# EAGLE design usbswitch (EAGLE 7.5.0)
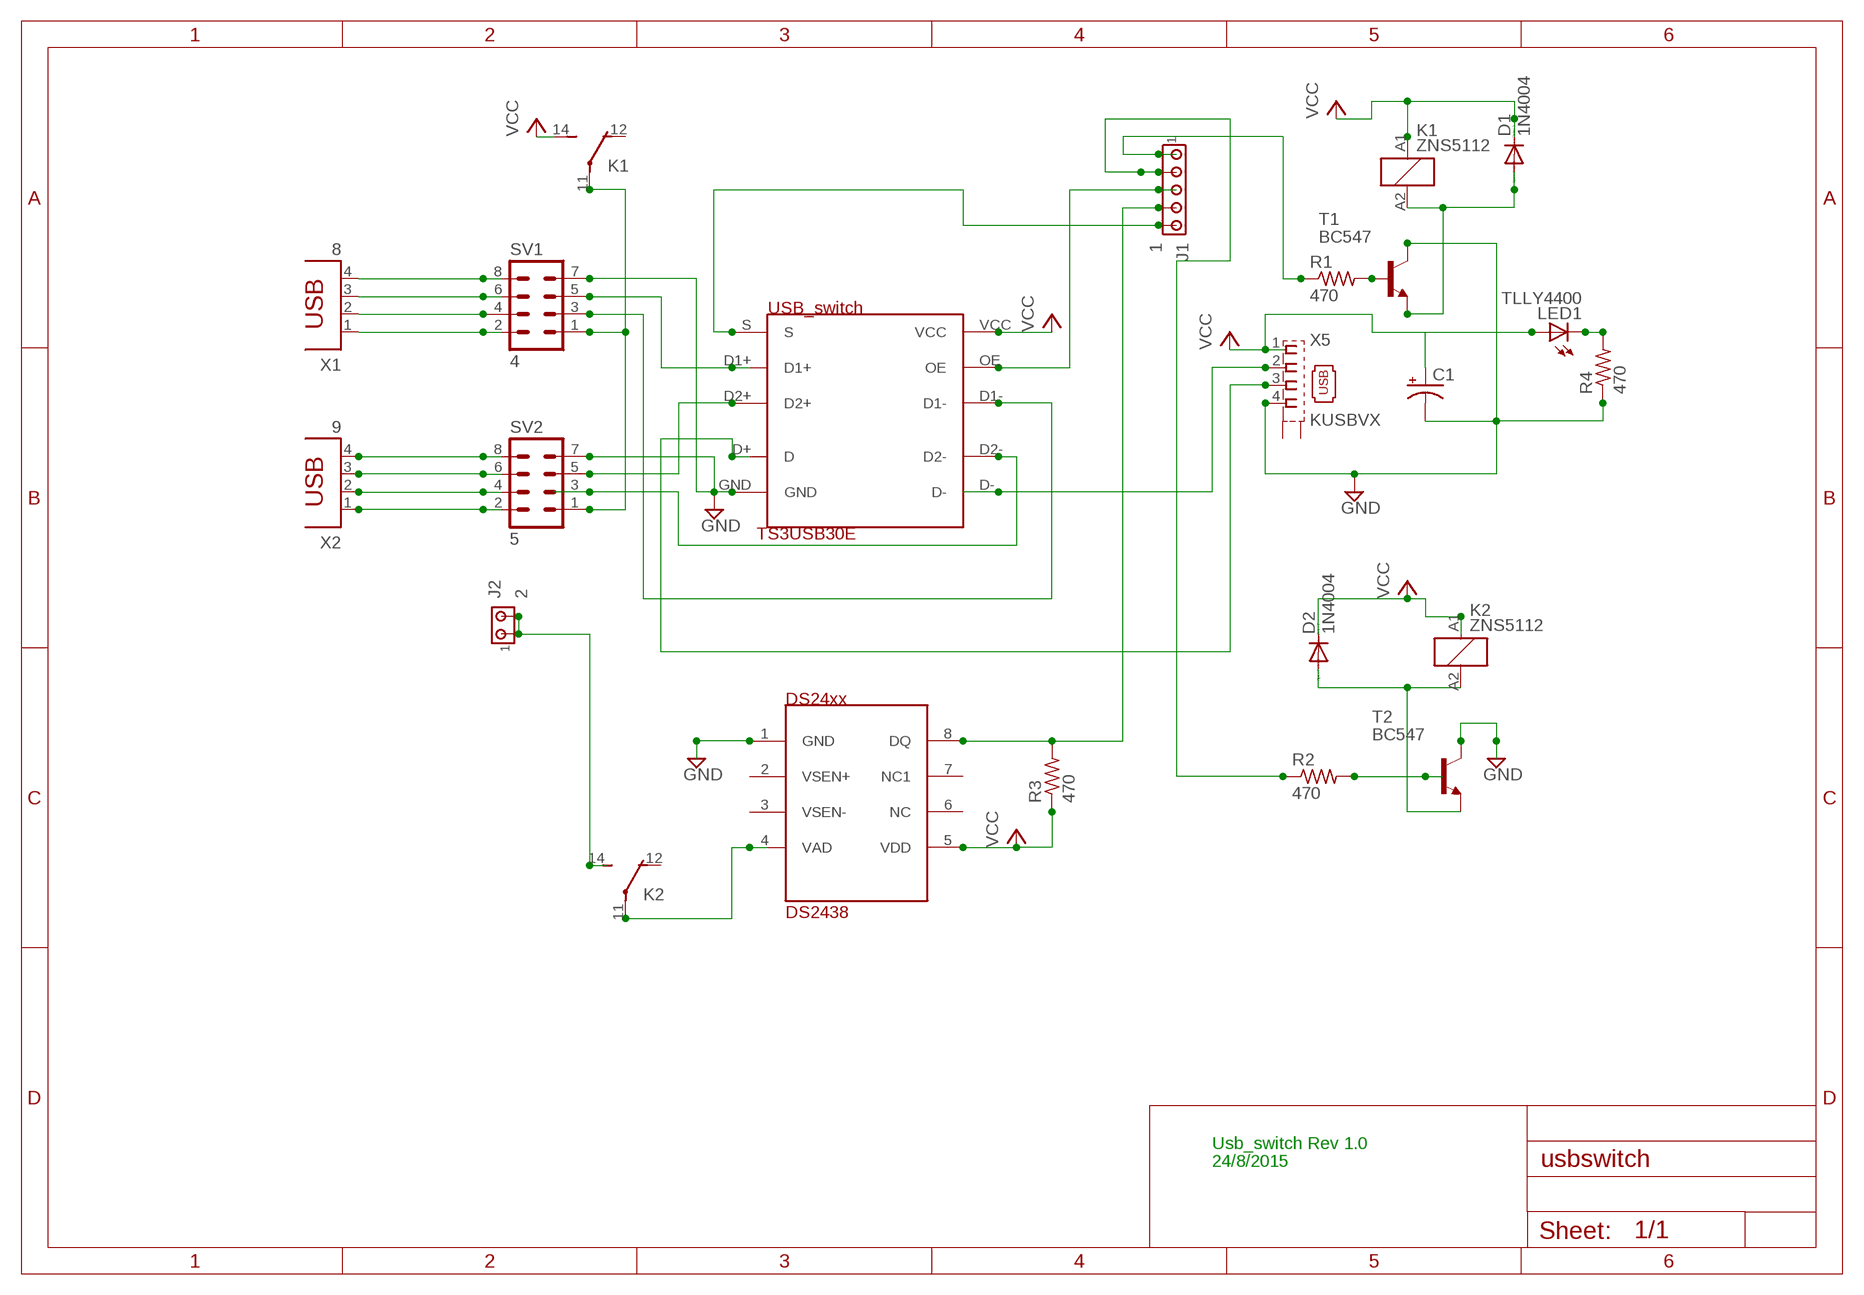
[diagram p0: schematic, sheet 1]

## Parts
C1  CPOL-USB45181A  [B45181A]
D1  1N4004  [DO41-10]
D2  1N4004  [DO41-10]
J1  1  MTA05-100  [10X05MTA]
J2  2  MTA02-156  [1X2MTA]
K1  ZNS5112  [ZN5]
K2  ZNS5112  [ZN5]
LED1  TLLY4400  [LED3MM]
R1  470  R-US_0204/5  [0204/5]
R2  470  R-US_0204/5  [0204/5]
R3  470  R-US_0204/5  [0204/5]
R4  470  R-US_0204/5  [0204/5]
SV1  4  MA04-2  [MA04-2]
SV2  5  MA04-2  [MA04-2]
T1  BC547  [TO92]
T2  BC547  [TO92]
U$1  USB_SWITCH  [PDSO-G10]
U$2  DS2438  [DS243PKG]
X1  8  PN87520  [PN87520]
X2  9  PN87520  [PN87520]
X5  KUSBVX  [KUSBVX]

## Nets
GND: C1.- R4.1 SV1.7 SV2.7 T1.3(C) T2.3(C) U$1.GND U$2.1(GND) X5.4
N$1: SV1.8 X1.4
N$2: SV1.6 X1.3
N$3: SV1.4 X1.2
N$4: J1.5 U$1.S
N$5: SV2.8 X2.4
N$6: SV2.6 X2.3
N$7: SV2.4 X2.2
N$8: R1.2 T1.2(B)
N$9: SV1.5 U$1.D1+
N$10: SV1.3 U$1.D1-
N$11: SV2.5 U$1.D2+
N$12: SV2.3 U$1.D2-
N$14: D1.A K1.A2 T1.1(E)
N$16: J1.3 U$1.OE
N$17: U$1.D- X5.2
N$18: U$1.D+(D) X5.3
N$23: J1.1 R1.1
N$36: J1.4 R3.2 U$2.8(DQ)
N$37: K2.11(2:P) U$2.4(VAD)
N$49: LED1.K(C) R4.2
N$50: SV1.2 X1.1
N$51: SV2.2 X2.1
N$52: K1.11(2:P) SV1.1 SV2.1
N$53: J2.1 J2.2 K2.14(2:S)
N$54: J1.2 R2.1
N$55: D2.A K2.A2 T2.1(E)
N$58: R2.2 T2.2(B)
VCC: C1.+ D1.C D2.C K1.14(2:S) K1.A1 K2.A1 LED1.A R3.1 U$1.VCC U$2.5(VDD) X5.1
Unconnected: K1.12(2:O) K2.12(2:O) U$2.2(VSEN+) U$2.3(VSEN-) U$2.6(NC) U$2.7(NC1) X5.M1(S1) X5.M2(S2)

## Notes on the sheet
- Usb_switch Rev 1.0
- 24/8/2015

## Library data of the parts
C1 = rcl:CPOL-US: POLARIZED CAPACITOR, American symbol
D1 D2 = diode:1N4004: DIODE general purpose rectifier, 1 A
J1 = con-amp:MTA05-100: AMP connector
J2 = con-amp:MTA02-156: AMP connector
K1 K2 = relay:ZNS5*: Miniature Power PCB Relay SCHRACK 1pole 10 A Source: http://www.schrack.com/.. 5847.pdf; OC_FARNELL: unknown; OC_NEWARK: unknown
LED1 = led:TLLY4400: Low Current (2mA) LED 3 mm Tinted Diffused Package color YELLOW Source: Data sheet <http://www.farnell.com/datasheets/391098.pdf>; MF: VISHAY SEMICONDUCTOR; OC_FARNELL: 1612439
R1-R4 = rcl:R-US_: RESISTOR, American symbol
SV1 SV2 = con-lstb:MA04-2: PIN HEADER; OC_FARNELL: unknown; OC_NEWARK: unknown
T1 T2 = transistor-neu-to92:BC547: NPN TRANSISTOR
U$1 = myusbswitch:USB_SWITCH: Usb_switch
U$2 = DS24xx:DS2438
X1 X2 = con-berg:PN87520: BERG USB connector; OC_FARNELL: unknown; OC_NEWARK: unknown
X5 = con-kycon:KUSBVX: Vertical,Top Entry Universal Serial Bus Connector KUSBVX Series Source: KYCON Sibalco USB vertical socket KUSBV.pdf

## Board
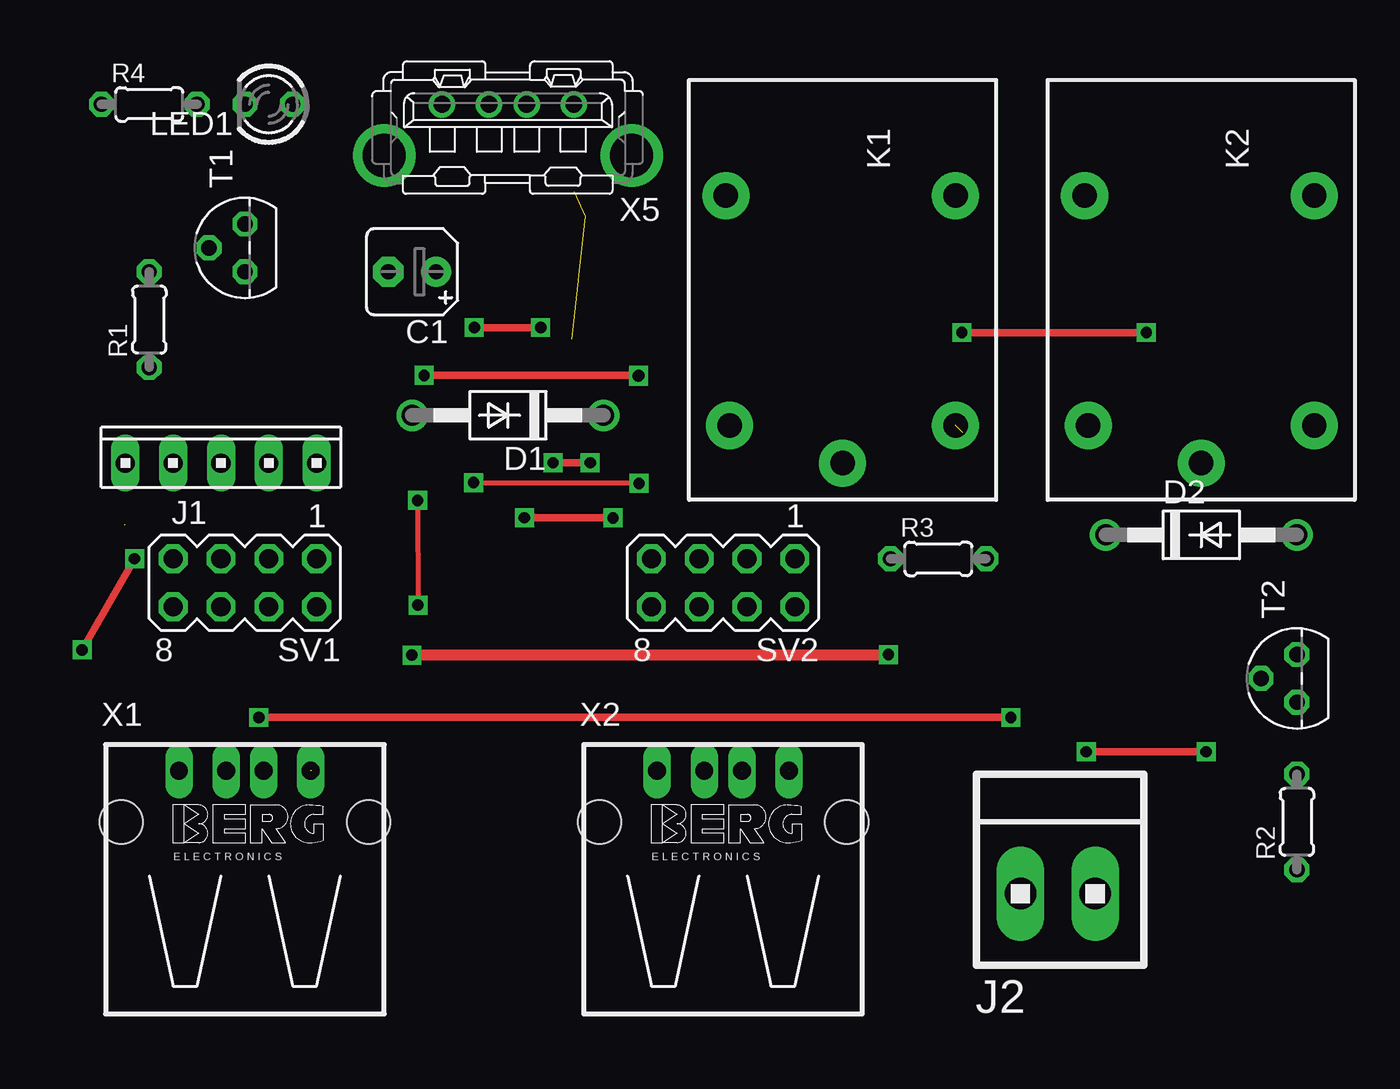
[diagram p1: board, top side]
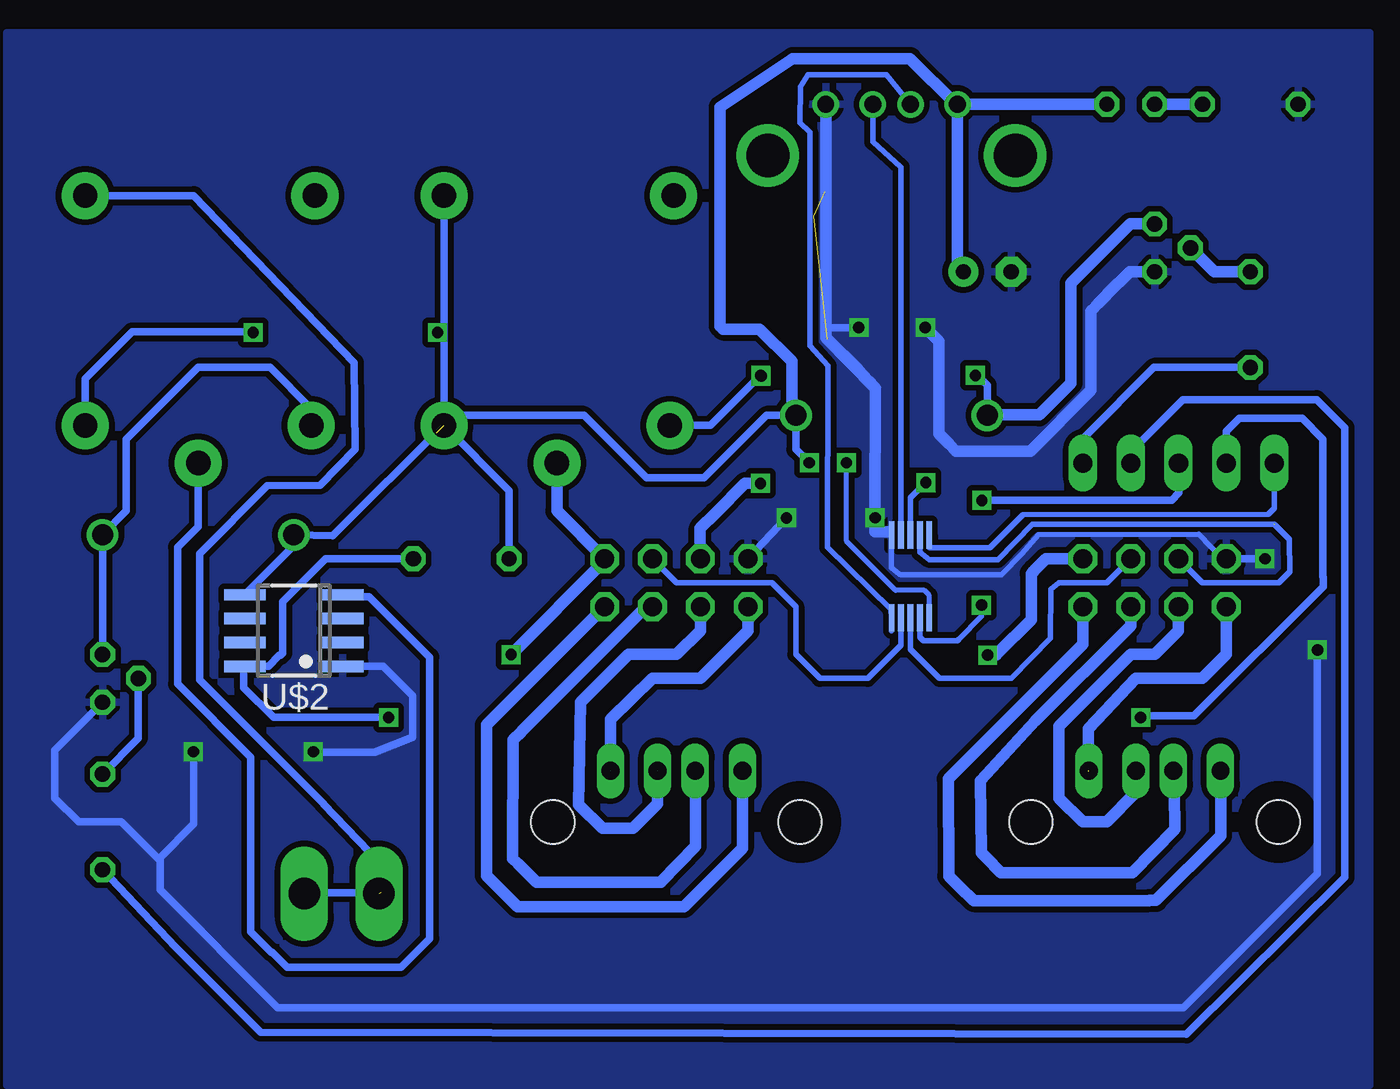
[diagram p2: board, bottom side, seen from below]

No outline drawn. Coordinates in mm, seen from the top.
Copper layers (1*16): Top 0.035mm / dielectric 1.5mm / Bottom 0.035mm
Design rules "default": minimum track width 10mil, minimum drill 24mil, track to track 8mil, track to pad 8mil, pad to pad 8mil, via to via 8mil, smd to smd 8mil, copper to edge 40mil, drill to drill 8mil, minimum pad ring 10mil, minimum via ring 8mil, stop-mask expansion 4mil, vias tented up to drill 0mil, thermal gap 10mil

### Footprints (pad centres in the part's own frame; a part is rotated, then mirrored left to right if it is on the bottom)
B45181A = drill 0.813 pad 1.6: + -1.27,0 | drill 0.813 pad 1.6 octagon: - 1.27,0
DO41-10 = drill 1.118: A 5.08,0; C -5.08,0
10X05MTA = drill 1.016 long: 1 5.08,0; 2 2.54,0; 3 0,0; 4 -2.54,0; 5 -5.08,0
1X2MTA = drill 1.676 long: 1 1.981,0; 2 -1.981,0
ZN5 = drill 1.3 pad 2.5: 11 8.89,0; 12 -5.31,-6.2; 14 -5.31,6; A1 6.89,6; A2 6.89,-6
LED3MM = drill 0.813 octagon: A -1.27,0; K 1.27,0
0204/5 = drill 0.813 octagon: 1 -2.54,0; 2 2.54,0
MA04-2 = drill 1.016 octagon: 1 -3.81,-1.27; 2 -3.81,1.27; 3 -1.27,-1.27; 4 -1.27,1.27; 5 1.27,-1.27; 6 1.27,1.27; 7 3.81,-1.27; 8 3.81,1.27
TO92 = drill 0.813 octagon: 1 1.27,0; 2 0,1.905; 3 -1.27,0
PDSO-G10 = smd 1.448 x 0.305: D1+ 0,1.5; D1- 4.4,1; D2+ 0,1; D2- 4.4,0.5; D+ 0,0.5; D- 4.4,0; GND 0,0; OE 4.4,1.5; S 0,2; VCC 4.4,2
DS243PKG = smd 2.2 x 0.6 bottom: 1 7.68,3.175; 2 7.68,1.905; 3 7.68,0.635; 4 7.68,-0.635; 5 2.48,-0.635; 6 2.48,0.635; 7 2.48,1.905; 8 2.48,3.175
PN87520 = drill 0.95 long: 1 -3.5,2.71; 2 -1,2.71; 3 1,2.71; 4 3.5,2.71 | hole 2.3: -6.57,0; 6.57,0
KUSBVX = drill 0.9 pad 1.3: 1 3.5,0; 2 1,0; 3 -1,0; 4 -3.5,0 | drill 2.3 pad 2.8: M1 -6.57,2.71; M2 6.57,2.71

### Placement (x,y rotation side)
C1  17.78,57.15 180 top
D1  22.86,49.53 180 top
D2  59.69,43.18 0 top
J1  7.62,46.99 0 top
J2  52.07,24.13 0 top
K1  40.64,55.88 270 top
K2  59.69,55.88 270 top
LED1  10.16,66.04 180 top
R1  3.81,54.61 90 top
R2  64.77,27.94 90 top
R3  45.72,41.91 0 top
R4  3.81,66.04 0 top
SV1  8.89,40.64 180 top
SV2  34.29,40.64 180 top
T1  8.89,58.42 90 top
T2  64.77,35.56 90 top
U$1  22.86,43.18 270 bottom
U$2  59.69,39.37 180 top
X1  8.89,27.94 0 top
X2  34.29,27.94 0 top
X5  22.86,66.04 180 top

### Tracks (layer width: path | path; a pad name or v marks a point on that pad's centre or on a via)
GND  (via drill 0.6)  (2 unrouted)
  Top 0.406: v53.57,31.67 v59.95,31.67 | v3.03,41.91 v0.25,37.07 | v23.74,44.09 v28.45,44.09 | v21.07,54.19 v24.6,54.19
  Bottom 0.305: SV1.7 5.29,41.91 6.54,43.22 15.07,43.18 15.95,42.17 | 15.95,42.17 | 15.95,42.17 17.04,41.06 21.35,41.06 22.37,41.07 22.44,41.09 22.86,41.43 U$1.GND 23.61,43.36 23.02,43.34
  Bottom 0.406: T2.3 67.31,31.75 67.31,29.21 66.04,27.94 63.79,27.94 61.71,25.87 | 61.71,25.87 61.71,24.34 55.46,18.09 7.38,18.09 0.25,25.2 v0.25,37.07 0.5,36.99 | 61.71,25.87 61.71,26.04 59.92,27.84 59.94,30.79 v59.95,31.67 | U$2.1 49.87,36.2 48.3,34.63 48.3,32.43 50.31,31.64 53.55,31.64 v53.57,31.67 | SV1.7 v3.03,41.91 | SV2.7 v28.45,44.09 | 20.35,53.3 20.35,53.47 | 24.08,51.36 24.09,51.36 26.29,53.55 26.29,54.17 24.66,54.17 24.62,54.21 v24.6,54.19
  Bottom 0.61: X5.4 26.36,53.65 23.72,50.97 | 23.72,50.97 v23.74,44.09 23.74,43.34 23.02,43.34 | T1.3 10.21,57.15 11.41,55.94 11.41,55.92 11.89,55.44 | 11.89,55.44 | 11.89,55.44 12.2,55.13 | 12.2,55.13 | 12.2,55.13 12.28,55.06 12.28,50.85 15.5,47.63 19.44,47.63 19.8,47.99 | 19.8,47.99 | 19.8,47.99 20.35,48.54 20.35,53.3 | 23.72,50.97 24.08,51.36 24.63,51.94 26.27,53.58 | 20.35,53.47 v21.07,54.19
  pour Bottom (isolate 0.305): -2.54,69.85 69.85,69.85 69.85,13.97 -2.54,13.97
N$1  (1 unrouted)
  Bottom 0.61: SV1.8 5.08,36.83 6.35,35.56 9.9,35.56 12.42,32.89 12.42,30.65
N$2
  Bottom 0.61: SV1.6 7.62,38.1 8.89,36.83 10.16,36.83 13.97,33.02 13.97,29.21 12.7,27.94 11.43,27.94 9.93,29.45 9.91,30.33 X1.3
N$3
  Bottom 0.61: SV1.4 10.16,38.36 15.24,33.28 15.21,33.33 18.13,30.14 18.1,26.29 17.86,26.05 17.86,26.06 17.04,25.24 10.08,25.25 7.82,27.56 7.85,29.49 X1.2
N$4
  Bottom 0.305: U$1.S 20.86,42.53 20.83,42.5 17.65,42.5 16.38,43.77 16.37,43.77 15.88,44.26 2.84,44.29 2.78,44.34 2.52,44.6 J1.5 | J1.5
N$5  (1 unrouted)
  Bottom 0.61: SV2.8 30.48,38.1 33.02,35.56 35.56,35.56 37.78,33.38 X2.4
N$6  (1 unrouted)
  Bottom 0.61: SV2.6 33.02,38.1 34.29,36.83 36.83,36.83 39.37,34.29 39.49,28.86 38.22,27.59 36.58,27.61 35.29,28.9 X2.3
N$7
  Bottom 0.61: SV2.4 35.91,39.37 38.02,37.25 | 38.02,37.25 | 38.02,37.25 41.54,33.74 | 41.54,33.74 | 41.54,33.74 42.53,32.75 42.53,32.73 42.96,32.3 42.98,25.99 42.74,25.75 42.71,25.73 41.72,24.74 35.12,24.74 35.1,24.75 | 35.1,24.75 | 35.1,24.75 33.29,26.65 33.29,30.57 X2.2
N$8
  Bottom 0.61: R1.2 5.71,57.15 T1.2
N$9  (1 unrouted)
  Bottom 0.305: SV1.5 6.35,40.64 2.3,40.64 1.72,41.22 1.74,42.95 2.52,43.73 | 2.54,43.74 15.38,43.74 17.22,41.87 20.84,41.87 21.36,42.26 U$1.D1+
N$10
  Bottom 0.305: U$1.D1- 21.86,37.1 20.32,35.56 16.51,35.56 14.42,37.7 14.4,40.3 13.97,40.64 11.43,40.64 SV1.3
N$11  (via drill 0.6)
  Top 0.305: v21.04,45.96 v29.83,45.91
  Bottom 0.305: U$1.D2+ 21.86,45.16 21.25,45.77 21.23,45.77 v21.04,45.96
  Bottom 0.61: SV2.5 33.03,43.53 32.22,44.34 30.64,45.91 v29.83,45.91
N$12
  Bottom 0.305: U$1.D2- 22.36,37.33 24.13,35.56 26.67,35.56 27.94,36.83 27.94,39.37 29.21,40.64 34.29,40.64 SV2.3
N$14  (via drill 0.6)
  Top 0.406: v29.81,51.65 v18.41,51.65
  Bottom 0.406: D1.A 17.78,51.13 18.35,51.7 v18.41,51.65 | K1.A2 32.47,48.99 v29.81,51.65
  Bottom 0.61: T1.1 10.18,59.69 13.33,56.54 13.33,51.24 15.01,49.55 17.76,49.55 D1.A
N$16  (via drill 0.6)
  Top 0.254: v18.06,45.01 v18.09,39.46
  Bottom 0.305: v18.09,39.46 18.09,38.85 19.29,37.65 19.38,37.56 21.18,37.56 21.36,37.74 U$1.OE | 7.61,45.5 7.61,45.42 | 9.08,45.03 9.1,45.03
  Bottom 0.406: J1.3 7.61,45.5 | 9.1,45.03 16.37,45.03 v18.06,45.01 | 7.61,45.42 7.98,45.03 9.08,45.03
N$17
  Bottom 0.305: 22.86,38.1 U$1.D- 22.89,39.24 26.26,42.52 26.23,52.16 27.21,53.23 27.21,64.55 27.72,65.06 27.71,66.98 27.3,67.6 23.13,67.6 X5.2
N$18
  Bottom 0.305: X5.3 23.86,65.89 23.86,64.05 22.36,62.7 U$1.D+
N$23
  Bottom 0.406: R1.1 8.93,52.07 12.62,48.38 12.7,48.04 J1.1
N$36  (via drill 0.6)
  Top 0.406: v9.63,33.48 v49.58,33.48
  Bottom 0.305: -0.05,40.95 -0.06,40.94 | 9.53,33.59 v9.63,33.48
  Bottom 0.406: J1.4 5.08,48.68 4.39,49.37 1.06,49.37 -0.05,48.26 -0.05,40.95 | -0.06,40.94 -0.06,40.43 6.81,33.59 9.53,33.59 | v49.58,33.48 55.68,33.48 57.26,35.07 57.26,36.14 U$2.8 55.96,36.2 55.38,36.78 55.32,36.78 55.2,36.9 55.2,39.62 52.91,41.91 R3.2
N$37
  Bottom 0.406: K2.11 59.69,43.62 60.78,42.53 60.78,35.27 56.9,31.38 56.9,22.11 55.82,21.03 55.77,21.03 54.96,20.22 48.92,20.22 47.4,21.74 47.4,36.69 50.6,39.9 51.91,39.9 U$2.4
N$43  (via drill 0.6)
  other vias: 29.79,51.61
N$49
  Bottom 0.61: LED1.K R4.2
N$50
  Bottom 0.61: SV1.2 12.7,37.38 16.69,33.38 | X1.1 5.39,27.21 8.82,23.78 9.15,23.78 9.19,23.77 18.5,23.77 19.27,24.51 19.29,24.53 19.82,25.06 19.84,30.23 18.17,31.91 16.69,33.38 | 16.69,33.38
N$51
  Bottom 0.61: X2.1 30.79,26.53 33.88,23.44 42.73,23.44 44.38,25.09 44.38,33.09 SV2.2
N$52  (via drill 0.6)
  Top 0.61: v17.76,36.8 v43.07,36.82
  Bottom 0.61: K1.11 40.64,44.45 SV2.1 38.1,41.8 v43.07,36.82 43.12,36.77 | SV1.1 14.68,41.91 15.11,41.48 | 15.11,41.48 | 15.11,41.48 15.28,41.31 15.28,41.29 15.37,41.19 | 15.37,41.19 | 15.37,41.19 15.44,41.12 15.44,38.69 17.24,36.89 | 17.24,36.89 | 17.24,36.89 17.33,36.8 v17.76,36.8
N$53  (1 unrouted)
  Bottom 0.406: K2.14 59.92,61.19 51.4,52.33 51.36,47.72 53.22,45.83 56.02,45.79 59.62,42.19 59.62,35.49 57.82,33.7 56.55,32.42 55.55,31.43 55.55,31.42 53.03,28.9 53.03,28.89 49.99,25.72 49.98,24.18 54,24.18 J2.1
N$54
  Bottom 0.406: J1.2 10.16,47.61 7.4,50.37 0.28,50.37 -0.9,49.19 -1.21,48.88 -1.21,25 7.2,16.68 56.37,16.78 59.68,20.09 60.89,21.3 R2.1
N$55
  Bottom 0.406: K2.A2 53.69,49.88 55.88,52.07 59.69,52.07 63.5,48.26 63.5,44.45 D2.A T2.1
N$58
  Bottom 0.406: T2.2 62.87,32.38 R2.2
VCC  (via drill 0.6)  (1 unrouted)
  Top 0.406: v25.26,47.01 v27.23,47.01 | v56.77,53.93 v46.98,53.93
  Bottom 0.254: U$1.VCC | U$1.VCC 20.86,39.97 21.12,40.23 22.65,40.23 25.26,42.84 v25.26,47.01
  Bottom 0.406: U$2.5 54.61,42.6 D2.C 52.56,43.14 52.13,43.55 47.07,48.61 47.03,48.61 46.12,49.53 | D1.C 29.5,49.53 32.82,46.22 35.89,46.22 39.2,49.53 46.12,49.53 | K1.14 46.64,53.59 | 46.64,53.59 46.64,50.05 46.12,49.53 | X5.1 19.45,66.04 | 31.97,54.27 31.81,54.11 | 28.16,49.75 D1.C | D1.C 27.94,47.72 v27.23,47.01 | K2.A1 65.69,51.48 63.2,53.96 56.8,53.96 v56.77,53.93 | v46.98,53.93 46.64,53.59 | R3.1 43.18,45.53 K1.A1 | C1.+ 19.36,57.15
  Bottom 0.61: 19.45,66.04 21.88,68.47 28.12,68.47 31.97,65.89 31.97,54.27 | 31.81,54.11 29.86,54.11 28.16,52.41 28.16,49.75 | 19.36,57.15 X5.1 LED1.A